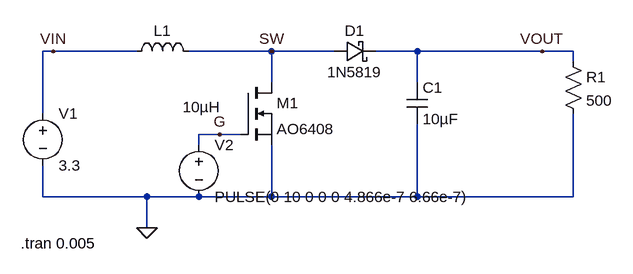
[diagram p0: schematic Boost Converter Simulation.asc]
Boost Converter Simulation.asc, the LTspice schematic file:
Version 4
SHEET 1 880 680
WIRE -48 112 -64 112
WIRE 80 112 -48 112
WIRE 288 112 160 112
WIRE 384 112 288 112
WIRE 512 112 448 112
WIRE 704 112 512 112
WIRE 752 112 704 112
WIRE 752 128 752 112
WIRE 288 160 288 112
WIRE 512 160 512 112
WIRE -64 208 -64 112
WIRE 208 240 176 240
WIRE 240 240 208 240
WIRE 176 256 176 240
WIRE -64 336 -64 288
WIRE 96 336 -64 336
WIRE 176 336 96 336
WIRE 288 336 288 256
WIRE 288 336 176 336
WIRE 512 336 512 224
WIRE 512 336 288 336
WIRE 752 336 752 208
WIRE 752 336 512 336
WIRE 96 384 96 336
FLAG 96 384 0
FLAG 288 112 SW
FLAG 704 112 VOUT
FLAG 208 240 G
FLAG -48 112 VIN
SYMBOL res 736 112 R0
SYMATTR InstName R1
SYMATTR Value 500
SYMBOL ind 64 128 R270
WINDOW 0 32 56 VTop 2
WINDOW 3 -54 116 VBottom 2
SYMATTR InstName L1
SYMATTR Value 10µH
SYMBOL schottky 384 96 M90
WINDOW 0 0 32 VBottom 2
WINDOW 3 32 32 VTop 2
SYMATTR InstName D1
SYMATTR Value 1N5819
SYMATTR Description Diode
SYMATTR Type diode
SYMBOL cap 496 160 R0
SYMATTR InstName C1
SYMATTR Value 10µF
SYMBOL nmos 240 160 R0
SYMATTR InstName M1
SYMATTR Value AO6408
SYMBOL voltage -64 192 R0
WINDOW 123 0 0 Left 0
WINDOW 39 0 0 Left 0
SYMATTR InstName V1
SYMATTR Value 3.3
SYMBOL voltage 176 240 R0
WINDOW 123 0 0 Left 0
WINDOW 39 0 0 Left 0
SYMATTR InstName V2
SYMATTR Value PULSE(0 10 0 0 0 4.866e-7 6.66e-7)
TEXT -98 408 Left 2 !.tran 0.005

The netlist it stands for:
* Boost Converter Simulation.asc
R1 VOUT 0 500
L1 VIN SW 10µH
D1 SW VOUT 1N5819
C1 VOUT 0 10µF
M1 SW G 0 0 AO6408
V1 VIN 0 3.3
V2 G 0 PULSE(0 10 0 0 0 4.866e-7 6.66e-7)
.model D D
.lib standard.dio
.model NMOS NMOS
.model PMOS PMOS
.lib standard.mos
.tran 0.005
.backanno
.end